# EasyEDA Pro project SaxStat_01.eprj

# Schematic Schematic_SaxStat_01
Board Name: SaxStat_01; Create Date: 2025-06-21; Page Name: P1; Project Name: SaxStat_01; Schematic Name: Schematic_SaxStat_01; Update Date: 2025-08-03; Company: EasyEDA.com; Page Size: A4; Version: V1.0
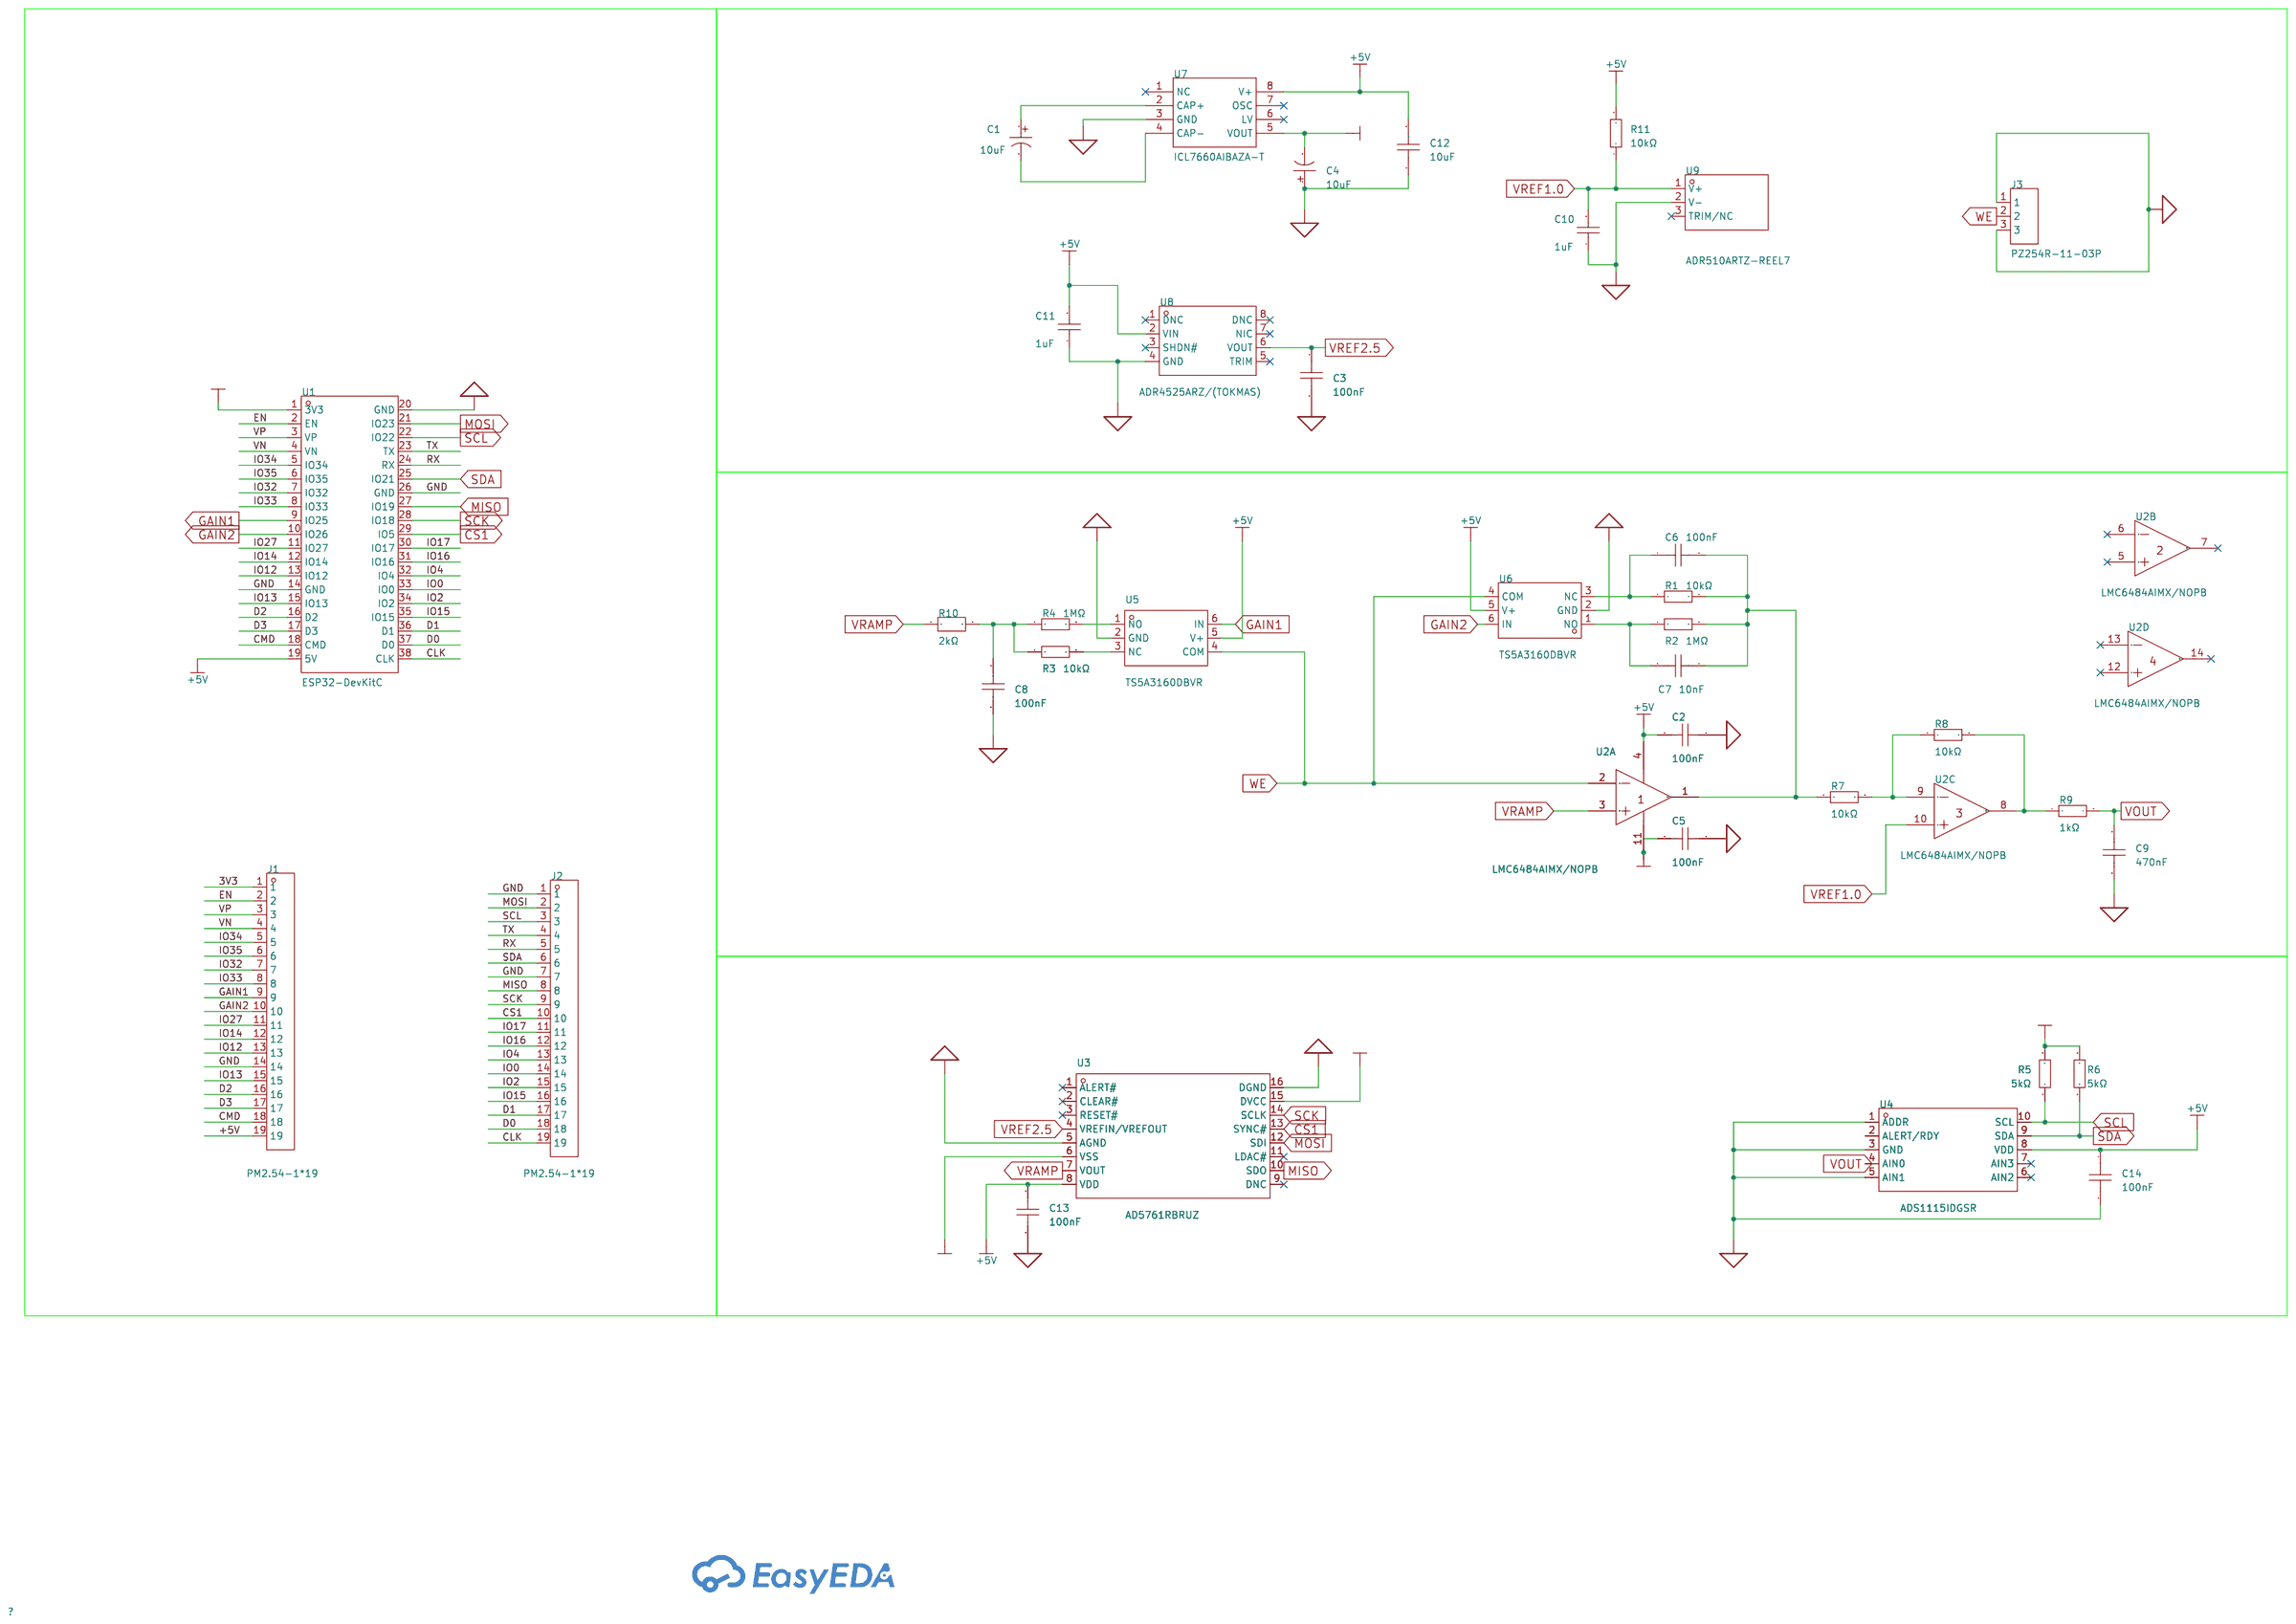
[diagram p0: schematic sheet]

## Parts
C1  10uF  [CAP-SMD_BD4.0-L4.3-W4.3-FD]
C2  100nF  [C0201]
C3  100nF  [C0201]
C4  10uF  [CAP-SMD_BD4.0-L4.3-W4.3-FD]
C5  100nF  [C0201]
C6  100nF  [C0201]
C7  10nF  [C0201]
C8  100nF  [C0201]
C9  470nF  [C0201]
C10  1uF  [C0201]
C11  1uF  [C0201]
C12  10uF  [C0402]
C13  100nF  [C0201]
C14  100nF  [C0201]
J1  PM2.54-1*19  [HDR-TH_19P-P2.54-V-F]
J2  PM2.54-1*19  [HDR-TH_19P-P2.54-V-F]
J3  PZ254R-11-03P  [HDR-TH_3P-P2.54-H-M-W10.4]
R1  10kΩ  [R0603]
R2  1MΩ  [R0603]
R3  10kΩ  [R0603]
R4  1MΩ  [R0603]
R5  5kΩ  [R0603]
R6  5kΩ  [R0603]
R7  10kΩ  [R0603]
R8  10kΩ  [R0603]
R9  1kΩ  [R0603]
R10  2kΩ  [R0603]
R11  10kΩ  [R0603]
U1  ESP32-DevKitC  [BULETM-SMD_ESP32-DEVKITC]
U2  LMC6484AIMX/NOPB  [SOIC-14_L8.7-W3.9-P1.27-LS6.0-BL]  (sections 1,2,3,4)
U3  AD5761RBRUZ  [TSSOP-16_L5.0-W4.4-P0.65-LS6.4-TL]
U4  ADS1115IDGSR  [MSOP-10_L3.0-W3.0-P0.50-LS5.0-BL]
U5  TS5A3160DBVR  [SOT-23-6_L2.9-W1.6-P0.95-LS2.8-BR]
U6  TS5A3160DBVR  [SOT-23-6_L2.9-W1.6-P0.95-LS2.8-BR]
U7  ICL7660AIBAZA-T  [SOIC-8_L5.0-W4.0-P1.27-LS6.0-BL]
U8  ADR4525ARZ/(TOKMAS)  [SOP-8_L4.9-W3.9-P1.27-LS6.0-BL]
U9  ADR510ARTZ-REEL7  [SOT-23-3_L2.9-W1.3-P1.90-LS2.4-BR]

## Library data of the parts
C1 C4 = RVT1E100M0405: LCSC Part Name: 10uF ±20% 25V; Supplier Part: C3343; Manufacturer: HONOR(荣誉); Supplier Footprint: SMD,D4xL5.4mm; JLCPCB Part Class: Extended Part; Datasheet: https://atta.szlcsc.com/upload/public/pdf/source/20250304/8AEF5A10740A8CC68A04B0B0B1D3A755.pdf; Supplier: LCSC; Tolerance: ±20%; Voltage Rating: 25V; Diameter: 4mm; Height - Seated (Max): 5.4mm; Lifetime: 2000hrs@105℃; Operating Temperature: -55℃~+105℃
C2 C3 C5 C6 C8 C13 C14 = CL03A104KQ3NNNC: LCSC Part Name: 100nF ±10% 6.3V; Supplier Part: C160831; Manufacturer: SAMSUNG(三星); Supplier Footprint: 0201; JLCPCB Part Class: Extended Part; Datasheet: https://atta.szlcsc.com/upload/public/pdf/source/20171228/C163510_15144412327381213809.pdf; Supplier: LCSC; Tolerance: ±10%
C7 = CL03A103KP3NNNC: LCSC Part Name: 10nF ±10% 10V; Supplier Part: C318549; Manufacturer: SAMSUNG(三星); Supplier Footprint: 0201; JLCPCB Part Class: Extended Part; Datasheet: https://atta.szlcsc.com/upload/public/pdf/source/20160218/1457707763339.pdf; Supplier: LCSC; Tolerance: ±10%
C9 = CL03A474KQ3NNNC: LCSC Part Name: 470nF ±10% 6.3V; Supplier Part: C318543; Manufacturer: SAMSUNG(三星); Supplier Footprint: 0201; JLCPCB Part Class: Extended Part; Datasheet: https://atta.szlcsc.com/upload/public/pdf/source/20160218/1457707763339.pdf; Supplier: LCSC; Tolerance: ±10%
C10 C11 = CL03A105MQ3CSNH: LCSC Part Name: 1uF ±20% 6.3V; Supplier Part: C53067; Manufacturer: SAMSUNG(三星); Supplier Footprint: 0201; JLCPCB Part Class: Extended Part; Datasheet: https://atta.szlcsc.com/upload/public/pdf/source/20160218/1457707763339.pdf; Supplier: LCSC; Tolerance: ±20%
C12 = CL05A106MP5NUNC_C315248: LCSC Part Name: 10uF ±20% 10V; Supplier Part: C315248; Manufacturer: SAMSUNG(三星); Manufacturer Part: CL05A106MP5NUNC; Supplier Footprint: 0402; JLCPCB Part Class: Extended Part; Datasheet: https://atta.szlcsc.com/upload/public/pdf/source/20231220/1EF805BAE1520675928CC4638D279E74.pdf; Supplier: LCSC; Tolerance: ±20%
J1 J2 = PM2.54-1*19: LCSC Part Name: 1x19P 间距:2.54mm; Supplier Part: C5371990; Manufacturer: ZHOURI(洲日); Supplier Footprint: 插件,P=2.54mm; JLCPCB Part Class: Extended Part; Supplier: LCSC; Holes Structure: 1x19P; Pitch: 2.54mm; Number of Rows: Single Row; Contact Plating: Gold
J3 = PZ254R-11-03P: LCSC Part Name: 1x3P 间距:2.54mm 方针 弯插; Supplier Part: C492411; Manufacturer: XFCN(兴飞); Supplier Footprint: 弯插,P=2.54mm; JLCPCB Part Class: Extended Part; Datasheet: https://atta.szlcsc.com/upload/public/pdf/source/20200309/C492411_5256E8AAA7569F6D33B6ADBFAE4F2888.pdf; Supplier: LCSC; Pin Structure: 1x3P; Pitch: 2.54mm; Circluar Pins/Square Pins: Policy; Mounting Type: Right-Angle; Number of Rows: Single Row; Number of Pins: 3P; Length of Mating Pin: 6mm; Insulation Height: 2.5mm; Contact Material: Brass; Operating Temperature: -40℃~+105℃; Color: Black
R1 R3 R7 R8 R11 = ARG03BTC1002: LCSC Part Name: 薄膜电阻 10kΩ ±0.1% 100mW; Supplier Part: C309083; Manufacturer: Viking(光颉); Supplier Footprint: 0603; JLCPCB Part Class: Extended Part; Datasheet: https://atta.szlcsc.com/upload/public/pdf/source/20190816/C412422_E173BA386C6DD8245B6A88358EF9877A.pdf; Supplier: LCSC; Type: Thin Film Resistor; Tolerance: ±0.1%; Temperature Coefficient: ±25ppm/℃; Operating Temperature Range: -55℃~+155℃
R2 R4 = RT0603BRD071ML: LCSC Part Name: 薄膜电阻 1MΩ ±0.1% 100mW; Supplier Part: C326730; Manufacturer: YAGEO(国巨); Supplier Footprint: 0603; JLCPCB Part Class: Extended Part; Datasheet: https://atta.szlcsc.com/upload/public/pdf/source/20181031/C326730_38CB34937BF84E118CC2FDDFD1DCDFCC.pdf; Supplier: LCSC; Type: Thin Film Resistor; Tolerance: ±0.1%; Temperature Coefficient: ±25ppm/℃; Operating Temperature Range: -55℃~+155℃
R5 R6 = RT0603BRE075KL: LCSC Part Name: 薄膜电阻 5kΩ ±0.1% 100mW; Supplier Part: C862232; Manufacturer: YAGEO(国巨); Supplier Footprint: 0603; JLCPCB Part Class: Extended Part; Datasheet: https://atta.szlcsc.com/upload/public/pdf/source/20200610/C326738_5639A9F1B6EB6E4AE2197577D3456E7F.pdf; Supplier: LCSC; Type: Thin Film Resistor; Tolerance: ±0.1%; Temperature Coefficient: ±50ppm/℃; Operating Temperature Range: -55℃~+155℃
R9 = RT0603BRD071KL: LCSC Part Name: 薄膜电阻 1kΩ ±0.1% 100mW; Supplier Part: C110776; Manufacturer: YAGEO(国巨); Supplier Footprint: 0603; JLCPCB Part Class: Extended Part; Datasheet: https://atta.szlcsc.com/upload/public/pdf/source/20170704/1499151282044.pdf; Supplier: LCSC; Type: Thin Film Resistor; Tolerance: ±0.1%; Temperature Coefficient: ±25ppm/℃; Operating Temperature Range: -55℃~+155℃
R10 = RT0603BRD072KL: LCSC Part Name: 薄膜电阻 2kΩ ±0.1% 100mW; Supplier Part: C728588; Manufacturer: YAGEO(国巨); Supplier Footprint: 0603; JLCPCB Part Class: Extended Part; Datasheet: https://atta.szlcsc.com/upload/public/pdf/source/20200814/C723483_9C38DBFE9BAEFED0FBB9716EAA9FF07C.pdf; Supplier: LCSC; Type: Thin Film Resistor; Tolerance: ±0.1%; Temperature Coefficient: ±25ppm/℃; Operating Temperature Range: -55℃~+155℃
U1 = ESP32-DevKitC: LCSC Part Name: 开发板; Supplier Part: C571180; Manufacturer: ESPRESSIF(乐鑫); JLCPCB Part Class: Extended Part; Datasheet: https://atta.szlcsc.com/upload/public/pdf/source/20200521/C529586_D6FCDAFCFF160B3EDDF7DF28D600699D.pdf; Supplier: LCSC
U2 = LMC6484AIMX/NOPB: LCSC Part Name: 四通道轨到轨输入输出CMOS运算放大器; Supplier Part: C67713; Manufacturer: TI(德州仪器); Supplier Footprint: SOIC-14; JLCPCB Part Class: Extended Part; Datasheet: https://www.ti.com/cn/lit/gpn/lmc6484; Supplier: LCSC; Number of Channels: QUAD; Maximum Power Supply Range (Vdd-Vss): 16V; Vos - Input Offset Voltage: 3mV; Input Offset Voltage Drift(Vos TC): 1uV/℃; Slew Rate: 1.3V/us; Ib - Input Bias Current: 0.02pA; Common Mode Rejection Ratio(CMRR): 82dB; Operating Temperature: -40℃~+85℃; Single supply: 3V~15.5V
U3 = AD5761RBRUZ: LCSC Part Name: 集成2 ppm/℃基准电压源的多范围、16/12位、双极性/单极性电压输出型DAC; Supplier Part: C404015; Manufacturer: ADI(亚德诺); Supplier Footprint: TSSOP-16; JLCPCB Part Class: Extended Part; Datasheet: https://atta.szlcsc.com/upload/public/pdf/source/20190722/C404015_21C88E48C88813C7B0010A18F7ED8816.pdf; Supplier: LCSC; Interface: SPI; Number of Channels: 1; Output Type: Voltage - Non-Buffered; Supply Voltage: 4.75V~30V; Resolution: 16-Bit; Integral nonlinearity: ±2LSB; Settling Time: 7.5us; Operating Temperature: -40℃~+125℃
U4 = ADS1115IDGSR: LCSC Part Name: 具有内部基准、振荡器和可编程比较器且兼容 I2C 的ADS111x、超小型、低功耗 860SPS、16位ADC; Supplier Part: C37593; Manufacturer: TI(德州仪器); Supplier Footprint: VSSOP-10; JLCPCB Part Class: Extended Part; Datasheet: https://www.ti.com/cn/lit/gpn/ads1115; Supplier: LCSC; Resolution(Bits): 16Bit; number of channels: 4; Voltage - Supply: 2V~5.5V; Interface: I2C; Integral non - linearity: 1LSB; Operating Temperature: -40℃~+125℃
U5 U6 = TS5A3160DBVR: LCSC Part Name: TS5A3160 1-Q SPDT 模拟开关; Supplier Part: C185770; Manufacturer: TI(德州仪器); Supplier Footprint: SOT-23-6; JLCPCB Part Class: Extended Part; Datasheet: https://www.ti.com/cn/lit/gpn/ts5a3160; Supplier: LCSC; Switch Circuit: SPDT(SPDT); Number of Channels: 1; Voltage - Supply: 1.65V~5.5V; Turn-on time: 6ns; RDS(on): 900mΩ; Turn-off time: 13ns; Operating Temperature: -40℃~+85℃
U7 = ICL7660AIBAZA-T: LCSC Part Name: 超电压转换器; Supplier Part: C7881; Manufacturer: RENESAS(瑞萨)/IDT; Supplier Footprint: SOIC-8; JLCPCB Part Class: Extended Part; Datasheet: https://atta.szlcsc.com/upload/public/pdf/source/20170116/1484561240262.pdf; Supplier: LCSC
U8 = ADR4525ARZ/(TOKMAS): Supplier Part: C18214520; Manufacturer: Tokmas(托克马斯); Supplier Footprint: SOIC-8; JLCPCB Part Class: Extended Part; Datasheet: https://atta.szlcsc.com/upload/public/pdf/source/20231010/4F5AAF5E7B6041A8A631750FC3EA245A.pdf; Supplier: LCSC; Output Type: Fixed; Input Voltage: 3V~15V; Output Voltage: 2.5V; Output Current: 10mA; Tolerance: ±0.04%
U9 = ADR510ARTZ-REEL7: Supplier Part: C77651; Manufacturer: ADI(亚德诺); Supplier Footprint: SOT-23; JLCPCB Part Class: Extended Part; Datasheet: https://atta.szlcsc.com/upload/public/pdf/source/20180126/C144251_15169559554471309048.pdf; Supplier: LCSC; Output Type: Fixed; Output Voltage: 1V; Output Current: 10mA; Tolerance: ±0.35%; Temperature Coefficient: 85ppm/℃; Reference Type: parallel connection; Operating Temperature: -40℃~+85℃@(Ta)

## Nets
3V3: J1.1 R5.2 R6.2 U1.1(3V3) U3.15(DVCC)
+5V: C2.1 C11.2 C12.2 C13.1 C14.1 J1.19 R11.2 U1.19(5V) U2.4(V+) U3.8(VDD) U4.8(VDD) U5.5(V+) U6.5(V+) U7.8(V+) U8.2(VIN)
-5V: C4.2 C5.1 U2.11(V-) U3.6(VSS) U7.5(VOUT)
GND: C2.2 C3.2 C4.1 C5.2 C8.2 C9.2 C10.1 C11.1 C12.1 C13.2 C14.2 J1.14 J2.1 J2.7 J3.1 J3.3 U1.14(GND) U1.20(GND) U1.26(GND) U3.5(AGND) U3.16(DGND) U4.1(ADDR) U4.3(GND) U4.5(AIN1) U5.2(GND) U6.2(GND) U7.3(GND) U8.4(GND) U9.2(V-)
CLK: J2.19 U1.38(CLK)
CMD: J1.18 U1.18(CMD)
CS1: J2.10 U1.29(IO5) U3.13(SYNC#)
D0: J2.18 U1.37(D0)
D1: J2.17 U1.36(D1)
D2: J1.16 U1.16(D2)
D3: J1.17 U1.17(D3)
EN: J1.2 U1.2(EN)
GAIN1: J1.9 U1.9(IO25) U5.6(IN)
GAIN2: J1.10 U1.10(IO26) U6.6(IN)
IO0: J2.14 U1.33(IO0)
IO2: J2.15 U1.34(IO2)
IO4: J2.13 U1.32(IO4)
IO12: J1.13 U1.13(IO12)
IO13: J1.15 U1.15(IO13)
IO14: J1.12 U1.12(IO14)
IO15: J2.16 U1.35(IO15)
IO16: J2.12 U1.31(IO16)
IO17: J2.11 U1.30(IO17)
IO27: J1.11 U1.11(IO27)
IO32: J1.7 U1.7(IO32)
IO33: J1.8 U1.8(IO33)
IO34: J1.5 U1.5(IO34)
IO35: J1.6 U1.6(IO35)
MISO: J2.8 U1.27(IO19) U3.10(SDO)
MOSI: J2.2 U1.21(IO23) U3.12(SDI)
RX: J2.5 U1.24(RX)
SCK: J2.9 U1.28(IO18) U3.14(SCLK)
SCL: J2.3 R5.1 U1.22(IO22) U4.10(SCL)
SDA: J2.6 R6.1 U1.25(IO21) U4.9(SDA)
TX: J2.4 U1.23(TX)
VN: J1.4 U1.4(VN)
VOUT: C9.1 R9.2 U4.4(AIN0)
VP: J1.3 U1.3(VP)
VRAMP: R10.1 U2.3(IN1+) U3.7(VOUT)
VREF1.0: C10.2 R11.1 U2.10(IN3+) U9.1(V+)
VREF2.5: C3.1 U3.4(VREFIN/VREFOUT) U8.6(VOUT)
WE: J3.2 U2.2(IN1-) U5.4(COM) U6.4(COM)
$1N1624: C6.1 R1.1 U6.3(NC)
$1N1625: C7.2 R2.1 U6.1(NO)
$1N1626: R4.2 U5.1(NO)
$1N1627: R3.2 U5.3(NC)
$1N1628: C8.1 R3.1 R4.1 R10.2
$1N1638: C1.1 U7.2(CAP+)
$1N6145: C6.2 C7.1 R1.2 R2.2 R7.1 U2.1(OUT1)
$1N6177: R7.2 R8.1 U2.9(IN3-)
$1N6252: R8.2 R9.1 U2.8(OUT3)
$1N12120: C1.2 U7.4(CAP-)

Not connected (* = marked no-connect by the designer): U2 5(IN2+)* 6(IN2-)* 7(OUT2)* 12(IN4+)* 13(IN4-)* 14(OUT4)*; U3 1(ALERT#)* 2(CLEAR#)* 3(RESET#)* 9(DNC)* 11(LDAC#)*; U4 2(ALERT/RDY) 6(AIN2)* 7(AIN3)*; U7 1(NC)* 6(LV)* 7(OSC)*; U8 1(DNC)* 3(SHDN#)* 5(TRIM)* 7(NIC)* 8(DNC)*; U9 3(TRIM/NC)*

# Board PCB_SaxStat_01
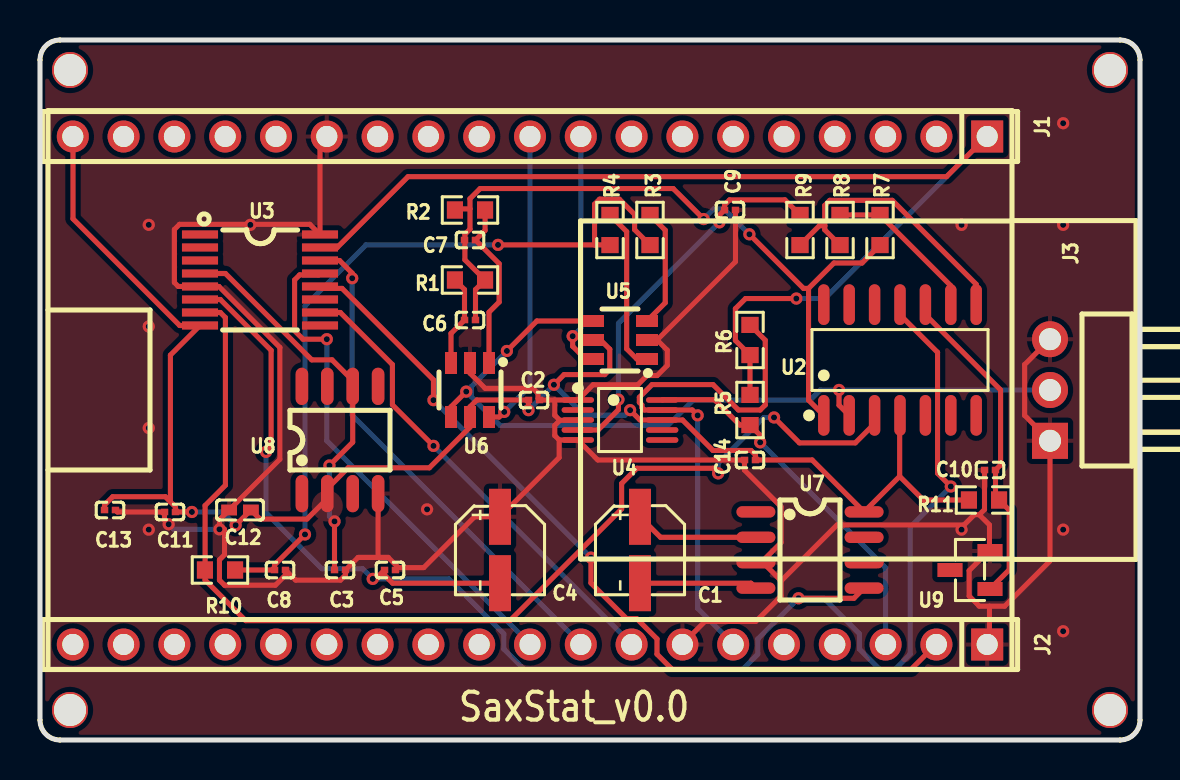
[diagram p1: board, top side]
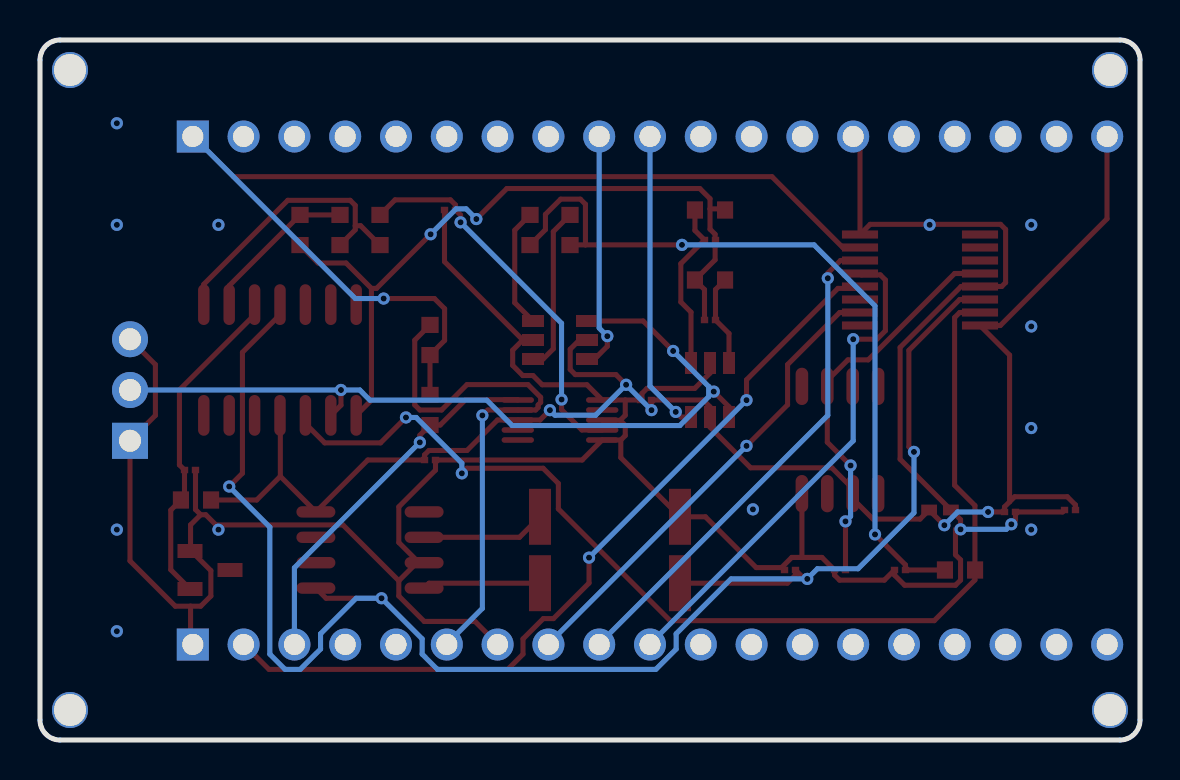
[diagram p2: board, bottom side, seen from below]

Outline 55 x 35 mm; copper layers: Top Layer, Bottom Layer. Coordinates in mm from the lower left corner of the outline.
Outline path: 0,34 0,1 arc(0.29,0.29) 1,0 54,0 arc(54.71,0.29) 55,1 55,34 arc(54.71,34.71) 54,35 1,35 arc(0.29,34.71) 0,34
Stack: Top Layer 0.035mm / Dielectric1 1.51mm FR4 er 4.5 / Bottom Layer 0.035mm

## Design rules (mm)
template: Custom Config
spacing copperThickness1oz (default): track to track 0.102, other pairs 0.152 to 0.3
spacing copperThickness2oz: track to track 0.203, other pairs 0.152 to 0.3
track width copperThickness1oz (default): min 0.127, default 0.254, max 2.54
track width copperThickness2oz: min 0.203, default 0.254, max 2.54
differential pair differentialPair (default): width min 0.127, default 0.254, max 2.54; gap min 0.152, default 0.152
via viaSize (default): diameter min 0.5, default 0.61, max 10; hole min 0.3, default 0.305, max 6.3

## Placement (name value [footprint] x y rotation side)
C1  10uF  [CAP-SMD_BD4.0-L4.3-W4.3-FD]  30 9.5 270 top
C2  100nF  [C0201]  24.7 17 0 top
C3  100nF  [C0201]  15 8.5 0 top
C4  10uF  [CAP-SMD_BD4.0-L4.3-W4.3-FD]  23 9.5 270 top
C5  100nF  [C0201]  17.5 8.5 0 top
C6  100nF  [C0201]  21.5 21 0 top
C7  10nF  [C0201]  21.5 25 0 top
C8  100nF  [C0201]  12 8.5 0 top
C9  470nF  [C0201]  34.5 26.5 0 top
C10  1uF  [C0201]  47.5 13.5 0 top
C11  1uF  [C0201]  6.5 11.4 0 top
C12  10uF  [C0402]  10 11.5 0 top
C13  100nF  [C0201]  3.5 11.5 0 top
C14  100nF  [C0201]  35.5 14 180 top
J1  PM2.54-1*19  [HDR-TH_19P-P2.54-V-F]  24.5 30.17 180 top
J2  PM2.54-1*19  [HDR-TH_19P-P2.54-V-F]  24.5 4.77 180 top
J3  PZ254R-11-03P  [HDR-TH_3P-P2.54-H-M-W10.4]  50.5 17.5 90 top
NOREF  -  [Pad_e47361]  1.5 33.5 0 top
NOREF#2  -  [Pad_e47363]  1.5 1.5 0 top
NOREF#3  -  [Pad_e47365]  53.5 33.5 0 top
NOREF#4  -  [Pad_e47364]  53.5 1.5 0 top
R1  10kΩ  [R0603]  21.5 23 0 top
R2  1MΩ  [R0603]  21.5 26.5 180 top
R3  10kΩ  [R0603]  30.5 25.5 90 top
R4  1MΩ  [R0603]  28.5 25.5 90 top
R5  5kΩ  [R0603]  35.5 16.5 90 top
R6  5kΩ  [R0603]  35.5 20 270 top
R7  10kΩ  [R0603]  42 25.5 90 top
R8  10kΩ  [R0603]  40 25.5 270 top
R9  1kΩ  [R0603]  38 25.5 90 top
R10  2kΩ  [R0603]  9 8.5 0 top
R11  10kΩ  [R0603]  47.2 12 180 top
U1  ESP32-DevKitC  [BULETM-SMD_ESP32-DEVKITC]  24.5 17.5 180 top
U2  LMC6484AIMX/NOPB  [SOIC-14_L8.7-W3.9-P1.27-LS6.0-BL]  43 19 0 top
U3  AD5761RBRUZ  [TSSOP-16_L5.0-W4.4-P0.65-LS6.4-TL]  11 23 0 top
U4  ADS1115IDGSR  [MSOP-10_L3.0-W3.0-P0.50-LS5.0-BL]  29 16 270 top
U5  TS5A3160DBVR  [SOT-23-6_L2.9-W1.6-P0.95-LS2.8-BR]  29 20 0 top
U6  TS5A3160DBVR  [SOT-23-6_L2.9-W1.6-P0.95-LS2.8-BR]  21.5 17.5 90 top
U7  ICL7660AIBAZA-T  [SOIC-8_L5.0-W4.0-P1.27-LS6.0-BL]  38.5 9.5 270 top
U8  ADR4525ARZ/(TOKMAS)  [SOP-8_L4.9-W3.9-P1.27-LS6.0-BL]  15 15 0 top
U9  ADR510ARTZ-REEL7  [SOT-23-3_L2.9-W1.3-P1.90-LS2.4-BR]  46.5 8.5 0 top

## Footprints (pads in the part's own frame, mm; a bottom-side part is the same pattern mirrored in y, then rotated)
BULETM-SMD_ESP32-DEVKITC
  round 1.5 hole 1: 1(-22.86,-12.7) 2(-20.32,-12.7) 3(-17.78,-12.7) 4(-15.24,-12.7) 5(-12.7,-12.7) 6(-10.16,-12.7) 7(-7.62,-12.7) 8(-5.08,-12.7) 9(-2.54,-12.7) 10(0,-12.7) 11(2.54,-12.7) 12(5.08,-12.7) 13(7.62,-12.7) 14(10.16,-12.7) 15(12.7,-12.7) 16(15.24,-12.7) 17(17.78,-12.7) 18(20.32,-12.7) 19(22.86,-12.7) 20(-22.86,12.7) 21(-20.32,12.7) 22(-17.78,12.7) 23(-15.24,12.7) 24(-12.7,12.7) 25(-10.16,12.7) 26(-7.62,12.7) 27(-5.08,12.7) 28(-2.54,12.7) 29(0,12.7) 30(2.54,12.7) 31(5.08,12.7) 32(7.62,12.7) 33(10.16,12.7) 34(12.7,12.7) 35(15.24,12.7) 36(17.78,12.7) 37(20.32,12.7) 38(22.86,12.7)
C0201
  rect 0.368x0.324 smd: 1(-0.275,0) 2(0.275,0)
C0402
  rect 0.79x0.54 smd: 1(-0.545,0) 2(0.545,0)
CAP-SMD_BD4.0-L4.3-W4.3-FD
  rect 2.8x1.1 smd: 1(-1.661,0) 2(1.661,0)
HDR-TH_3P-P2.54-H-M-W10.4
  rect 1.8x1.8 hole 1.1: 1(-2.54,0)
  round 1.8 hole 1.1: 2(0,0) 3(2.54,0)
HDR-TH_19P-P2.54-V-F
  rect 1.6x1.6 hole 1.05: 1(-22.86,0)
  round 1.6 hole 1.05: 2(-20.32,0) 3(-17.78,0) 4(-15.24,0) 5(-12.7,0) 6(-10.16,0) 7(-7.62,0) 8(-5.08,0) 9(-2.54,0) 10(0,0) 11(2.54,0) 12(5.08,0) 13(7.62,0) 14(10.16,0) 15(12.7,0) 16(15.24,0) 17(17.78,0) 18(20.32,0) 19(22.86,0)
MSOP-10_L3.0-W3.0-P0.50-LS5.0-BL
  oval 0.28x1.62 smd: 1(-1,-2.11) 2(-0.5,-2.11) 3(0,-2.11) 4(0.5,-2.11) 5(1,-2.11) 6(1,2.11) 7(0.5,2.11) 8(0,2.11) 9(-0.5,2.11) 10(-1,2.11)
Pad_e47361
  round 1.8 hole 1.6: 1(0,0)
Pad_e47363
  round 1.8 hole 1.6: 2(0,0)
Pad_e47364
  round 1.8 hole 1.6: 3(0,0)
Pad_e47365
  round 1.8 hole 1.6: 4(0,0)
R0603
  rect 0.806x0.864 smd: 1(-0.753,0) 2(0.753,0)
SOIC-8_L5.0-W4.0-P1.27-LS6.0-BL
  oval 0.569x1.95 smd: 1(-1.905,-2.705) 2(-0.635,-2.705) 3(0.635,-2.705) 4(1.905,-2.705) 5(1.905,2.705) 6(0.635,2.705) 7(-0.635,2.705) 8(-1.905,2.705)
SOIC-14_L8.7-W3.9-P1.27-LS6.0-BL
  oval 0.574x2.038 smd: 1(-3.81,-2.769) 2(-2.54,-2.769) 3(-1.27,-2.769) 4(0,-2.769) 5(1.27,-2.769) 6(2.54,-2.769) 7(3.81,-2.769) 8(3.81,2.769) 9(2.54,2.769) 10(1.27,2.769) 11(0,2.769) 12(-1.27,2.769) 13(-2.54,2.769) 14(-3.81,2.769)
SOP-8_L4.9-W3.9-P1.27-LS6.0-BL
  oval 0.63x1.865 smd: 1(-1.905,-2.683) 2(-0.635,-2.683) 3(0.635,-2.683) 4(1.905,-2.683) 5(1.905,2.683) 6(0.635,2.683) 7(-0.635,2.683) 8(-1.905,2.683)
SOT-23-3_L2.9-W1.3-P1.90-LS2.4-BR
  rect 1.25x0.7 smd: 1(1,-0.95) 2(1,0.95) 3(-1,0)
SOT-23-6_L2.9-W1.6-P0.95-LS2.8-BR
  rect 1.1x0.6 smd: 1(1.35,-0.95) 2(1.35,0) 3(1.35,0.95) 4(-1.35,0.95) 5(-1.35,0) 6(-1.35,-0.95)
TSSOP-16_L5.0-W4.4-P0.65-LS6.4-TL
  rect 1.804x0.406 smd: 1(-3,2.275) 2(-3,1.625) 3(-3,0.975) 4(-3,0.325) 5(-3,-0.325) 6(-3,-0.975) 7(-3,-1.625) 8(-3,-2.275) 9(3,-2.275) 10(3,-1.625) 11(3,-0.975) 12(3,-0.325) 13(3,0.325) 14(3,0.975) 15(3,1.625) 16(3,2.275)

## Nets
As in the schematic.

Pads without a net: NOREF 1; NOREF#2 2; NOREF#3 4; NOREF#4 3; U2 5 6 7 12 13 14; U3 1 2 3 9 11; U4 2 6 7; U7 1 6 7; U8 1 3 5 7 8; U9 3

## Via types
v1: diameter 0.61, hole 0.305, Top Layer to Bottom Layer, 46 vias

## Routing (per net, layer and track width the routed paths; a pad name or vN(x,y) marks a point on that pad's centre or on a via; arc(x,y) is an arc through that point)
3V3: length 56.4
  Top Layer w0.254: R5.2 R6.2 34.77,19.98 34.77,21.56 35.28,22.07 v1(37.82,22.07) ; U1.1 45.33,28.17 18.4,28.17 14.86,24.62 U3.15
  Bottom Layer w0.254: U1.1 39.23,22.07 v1(37.82,22.07)
+5V: length 83.8
  Top Layer w0.254: U5.5 28.03,20 28.49,19.54 28.49,18.52 28.24,18.27 26.2,18.27 v1(25.7,17.76) ; 6.52,11.91 6.77,11.66 C11.2 v1(7.6,11.4) ; 6.52,11.91 6.27,12.16 3.64,12.16 3.23,11.75 C13.1 ; 6.52,11.91 6.52,19.25 U3.8 6.98,20.72 1.65,26.06 1.65,30.16 J1.19 ; 42.98,13.18 42.98,16.21 U2.4 ; 42.98,13.18 44.17,12 R11.2 ; 42.98,13.18 U7.8 38.61,14 C14.1 35.77,14.25 35.55,14.48 33.65,14.48 32.13,16 U4.8 30,16 v1(29.51,16.49) ; v1(9.78,10.74) C12.2 11,11.05 13.35,11.05 14.37,12.06 U8.2 14.51,12.46 14.51,12.71 15.4,13.61 19.47,13.61 21.5,15.64 U6.5 21.5,16.66 21.84,17 C2.1 v1(24.43,16.49)
  Bottom Layer w0.254: v1(24.43,16.49) v1(25.7,17.76) 27.22,16.24 29.25,16.24 v1(29.51,16.49) ; v1(7.6,11.4) 9.12,11.4 v1(9.78,10.74)
-5V: length 82.7
  Top Layer w0.254: C4.2 17.63,7.84 17.23,8.25 C5.1 16.78,8.06 v1(16.64,8.06) ; U3.6 9.02,22.03 11.56,19.48 11.56,14.66 v1(11.3,14.41) ; v1(45.54,12.67) 44.88,13.34 44.88,19.38 43,21.26 U2.11 ; v1(37.92,7.09) 40.7,7.09 U7.5
  Bottom Layer w0.254: v1(11.3,14.41) 11.3,11.36 14.1,8.56 16.13,8.56 v1(16.64,8.06) 20.45,8.06 23.19,5.31 23.19,4.55 24.21,3.53 35.13,3.53 35.89,4.29 35.89,5.06 v1(37.92,7.09) 39.19,7.09 40.97,5.31 40.97,4.55 41.99,3.53 42.75,3.53 43.51,4.29 43.51,10.64 v1(45.54,12.67)
GND: length 153.4
  Top Layer w0.254: C13.2 3.87,11.4 C11.1 6.23,10.99 v1(6.43,10.79) ; 46.96,11.26 47.47,10.75 47.47,9.48 ; 46.96,11.26 46.71,11.26 46.2,10.75 39.85,10.75 37.06,7.96 ; 46.96,11.26 47.23,11.52 C10.1 ; 36.04,8.86 36.16,8.86 37.06,7.96 ; 36.04,8.86 U7.3 ; 36.04,8.86 37.06,9.88 37.06,11.66 35.23,13.49 C14.2 27.89,14 U4.5 25.96,15 ; 30.86,20 U5.2 ; 30.86,20 34.77,23.92 C9.2 ; 30.86,20 31.37,19.49 31.37,18.73 30.86,18.22 30.35,18.22 29.89,17.76 27.65,17.76 U4.1 25.74,17 ; 17.92,8.62 19.19,8.62 21.73,11.16 C4.1 25.96,14.12 25.96,15 ; 17.92,8.62 17.9,8.62 C5.2 ; 17.92,8.62 17.41,9.13 16.9,9.13 ; 8.97,10.79 8.97,11.02 C12.1 12,14.04 12,19.63 8.95,22.68 U3.5 ; 8.97,10.79 9.23,10.53 9.23,9.26 8.97,9.01 8.97,7.99 9.23,7.74 11.77,7.74 12.27,8.25 C8.2 12.78,7.99 15.02,7.99 15.27,8.25 C3.2 15.9,9.13 16.9,9.13 ; 8.97,10.79 v1(8.97,10.53) ; 47.47,6.69 46.96,6.69 46.46,7.2 46.46,8.47 47.47,9.48 ; 47.47,6.69 48.23,6.69 50.5,8.96 J3.1 49.23,16.23 49.23,18.77 J3.3 ; 47.47,6.69 47.47,4.91 U1.20 ; J1.14 14,29.83 U3.16 13.49,25.78 6.97,25.78 6.72,25.53 6.72,22.87 6.92,22.68 7.93,22.68 ; U3.5 7.93,22.68 ; U3.5 7.93,22.68 ; 16.9,9.13 16.9,12.32 ; 37.06,7.96 37.06,7.2 35.79,5.93 33.25,5.93 U1.26 ; 47.47,9.48 U9.2 ; U4.3 26.87,15.98 25.99,15.98 ; 25.74,17 C2.2 24.9,17.07 24.9,17.33 24.65,17.58 22.26,17.58 21.5,18.34 U6.2 ; 25.74,17 25.74,16.24 25.99,15.98 ; 25.96,15 25.74,15.22 25.74,15.73 25.99,15.98
  Bottom Layer w0.254: v1(8.97,10.53) 6.69,10.53 v1(6.43,10.79)
  vias: v1(5.44,25.76) v1(5.44,20.68) v1(5.44,15.6) v1(5.44,10.52) v1(10.52,25.76) v1(19.35,11.53) v1(46.08,25.76) v1(46.08,10.52) v1(51.16,30.84) v1(51.16,25.76) v1(51.16,10.52) v1(51.16,5.44)
CS1: length 25.2
  Top Layer w0.254: U3.13 13.93,23.26 12.98,23.26 12.73,23 12.73,20.46 13.15,20.04 v1(14.34,20.04)
  Bottom Layer w0.254: v1(14.34,20.04) 14.34,14.96 U1.29
GAIN1: length 12
  Top Layer w0.254: v1(26.63,20.19) 26.63,19.68 27.14,19.18 27.52,19.18 U5.6
  Bottom Layer w0.254: v1(26.63,20.19) 27.04,20.6 U1.9
GAIN2: length 15.2
  Top Layer w0.254: v1(23.21,16.4) 22.96,16.15 U6.6
  Bottom Layer w0.254: v1(23.21,16.4) 24.5,17.69 J1.10
MISO: length 23.6
  Top Layer w0.254: U3.10 15.02,21.38 17.62,18.77 17.62,16.76 v1(19.67,14.71)
  Bottom Layer w0.254: U1.27 v1(19.67,14.71)
MOSI: length 41.1
  Top Layer w0.254: v1(27.55,9.12) 27.55,7.85 29.33,6.07 29.83,6.07 30.85,5.05 30.85,4.29 31.61,3.53 43.55,3.53 U1.21 ; U3.12 14.09,22.58 15.1,22.58 19.67,18.01 v1(19.67,16.99)
  Bottom Layer w0.254: v1(27.55,9.12) v1(19.67,16.99)
SCK: length 25.1
  Top Layer w0.254: v1(15.61,23.09) 15.61,23.34 14.98,23.97 U3.14
  Bottom Layer w0.254: v1(15.61,23.09) 15.61,16.23 U1.28
SCL: length 18.7
  Top Layer w0.254: v1(36.01,14.88) 36.01,15.24 R5.1 34.99,15.75 33.72,17.02 31.13,17.02 U4.10
  Bottom Layer w0.254: v1(36.01,14.88) 42.28,8.61 U1.22
SDA: length 27.2
  Top Layer w0.254: v1(32.88,16.23) 32.61,16.5 U4.9 30.22,16.5 30.09,16.63 30.09,16.75 29.97,16.88 29.97,17.14 30.6,17.77 33.65,17.77 34.92,16.5 36.01,16.5 36.26,16.75 36.26,19.99 R6.1
  Bottom Layer w0.254: v1(32.88,16.23) 32.88,6.58 U1.25
VOUT: length 19.1
  Top Layer w0.254: v1(28.92,17.02) 28.92,16.52 27.91,15.5 U4.4 ; R9.2 37.25,27.01 34.48,27.01 34.23,26.75 C9.1 33.97,26.25 v1(33.97,25.88)
  Bottom Layer w0.254: v1(33.97,25.88) 28.92,20.83 v1(28.92,17.02)
VRAMP: length 56
  Top Layer w0.254: U3.7 9.02,21.38 9.27,21.12 9.27,12.74 8.25,11.72 8.25,8.51 ; v1(33.91,13.33) 33.65,13.59 29.84,13.59 29.08,12.83 29.08,11.56 23.49,5.97 10.29,5.97 8.25,8 8.25,8.51 ; 8.25,8.51 R10.1 ; v1(36.7,16.13) 37.97,14.86 40.77,14.86 41.73,15.82 U2.3
  Bottom Layer w0.254: v1(36.7,16.13) 36.19,16.13 33.91,13.84 v1(33.91,13.33)
VREF1.0: length 16.6
  Top Layer w0.254: U2.10 44.27,21.26 48.03,17.5 48.03,13.75 C10.2 47.77,12.18 R11.1 48.46,11.49 48.46,8.51 U9.1
VREF2.5: length 19.9
  Top Layer w0.254: v1(14.73,10.93) C3.1 ; v1(14.47,13.72) 15.63,14.89 U8.6 15.62,17.7 15.62,17.99 14.6,19.01 13.59,19.01 9.27,23.33 U3.4
  Bottom Layer w0.254: v1(14.47,13.72) 14.47,11.19 v1(14.73,10.93)
WE: length 41.6
  Top Layer w0.254: U6.4 20.55,16.66 v1(21.31,17.42) ; U2.2 39.95,16.74 v1(39.95,17.5) ; U5.4 24.84,20.95 v1(23.34,19.45)
  Bottom Layer w0.254: J3.2 v1(39.95,17.5) 39.01,17.5 38.5,16.99 32.66,16.99 31.39,15.72 23.01,15.72 21.57,17.17 21.57,17.67 ; v1(21.31,17.42) 21.57,17.67 ; 21.57,17.67 v1(23.34,19.45)
$1N1624: length 4.6
  Top Layer w0.254: R1.1 21.23,22.52 C6.1 20.55,20.32 U6.3
$1N1625: length 8.5
  Top Layer w0.254: R2.1 22.25,25.48 C7.2 22.96,23.82 22.96,21.9 22.45,21.39 U6.1
$1N1626: length 8.3
  Top Layer w0.254: U5.1 29.84,19.05 29.33,19.56 29.33,25.42 R4.2
$1N1627: length 6
  Top Layer w0.254: R3.2 31.26,25.49 31.26,21.86 U5.3
$1N1628: length 38.6
  Top Layer w0.254: v1(13.25,10.28) 11.73,8.75 C8.1 R10.2 ; R4.1 28.49,24.76 27.73,24.76 ; 27.73,24.76 v1(22.9,24.76) ; 27.73,24.76 27.73,26.79 27.98,27.04 28.97,27.04 29.73,26.28 29.73,25.52 R3.1
  Bottom Layer w0.254: v1(22.9,24.76) 16.3,24.76 13.25,21.71 v1(13.25,10.28)
$1N1638: length 6.2
  Top Layer w0.254: U7.2 31.03,10.14 C1.1
$1N6145: length 38.3
  Top Layer w0.254: v1(33.18,26.05) 31.66,27.57 22.01,27.57 21.5,27.06 21.5,26.56 ; R7.1 41.1,23.85 39.7,23.85 38.43,22.58 ; v1(35.47,25.29) 38.17,22.58 38.43,22.58 ; C6.2 21.77,22.52 R1.2 21.25,24.01 21.25,25.29 21.5,25.54 21.5,26.56 ; 38.43,22.58 38.43,16.99 U2.1 ; R2.2 20.8,26.56 21.5,26.56
  Bottom Layer w0.254: v1(33.18,26.05) 33.69,26.56 34.2,26.56 v1(35.47,25.29)
$1N6177: length 8
  Top Layer w0.254: U2.9 45.54,22.71 R7.2 R8.1
$1N6252: length 14.4
  Top Layer w0.254: 39.24,25.71 39.24,25.51 R8.2 ; 39.24,25.71 38.97,25.71 R9.1 ; 39.24,25.71 39.24,26.73 39.49,26.98 42.61,26.98 46.81,22.78 U2.8
$1N12120: length 5.9
  Top Layer w0.254: U7.4 35.55,7.84 C1.2

## Copper pours and planes (outline as drawn; the poured copper is in the pictures)
AGND on Bottom Layer: -1.52,37.29 57.4,37.29 57.4,-1.45 -1.52,-1.45
GND on Top Layer: -2.03,36.78 56.26,36.78 56.26,-0.56 -2.03,-0.56

## Text on the board
Top Silkscreen Layer: SaxStat_v0.0
